# Altium schematic sheet 01_Overview.SchDoc
size A4; DocumentNumber: 1; SheetNumber: 1; SheetTotal: 8
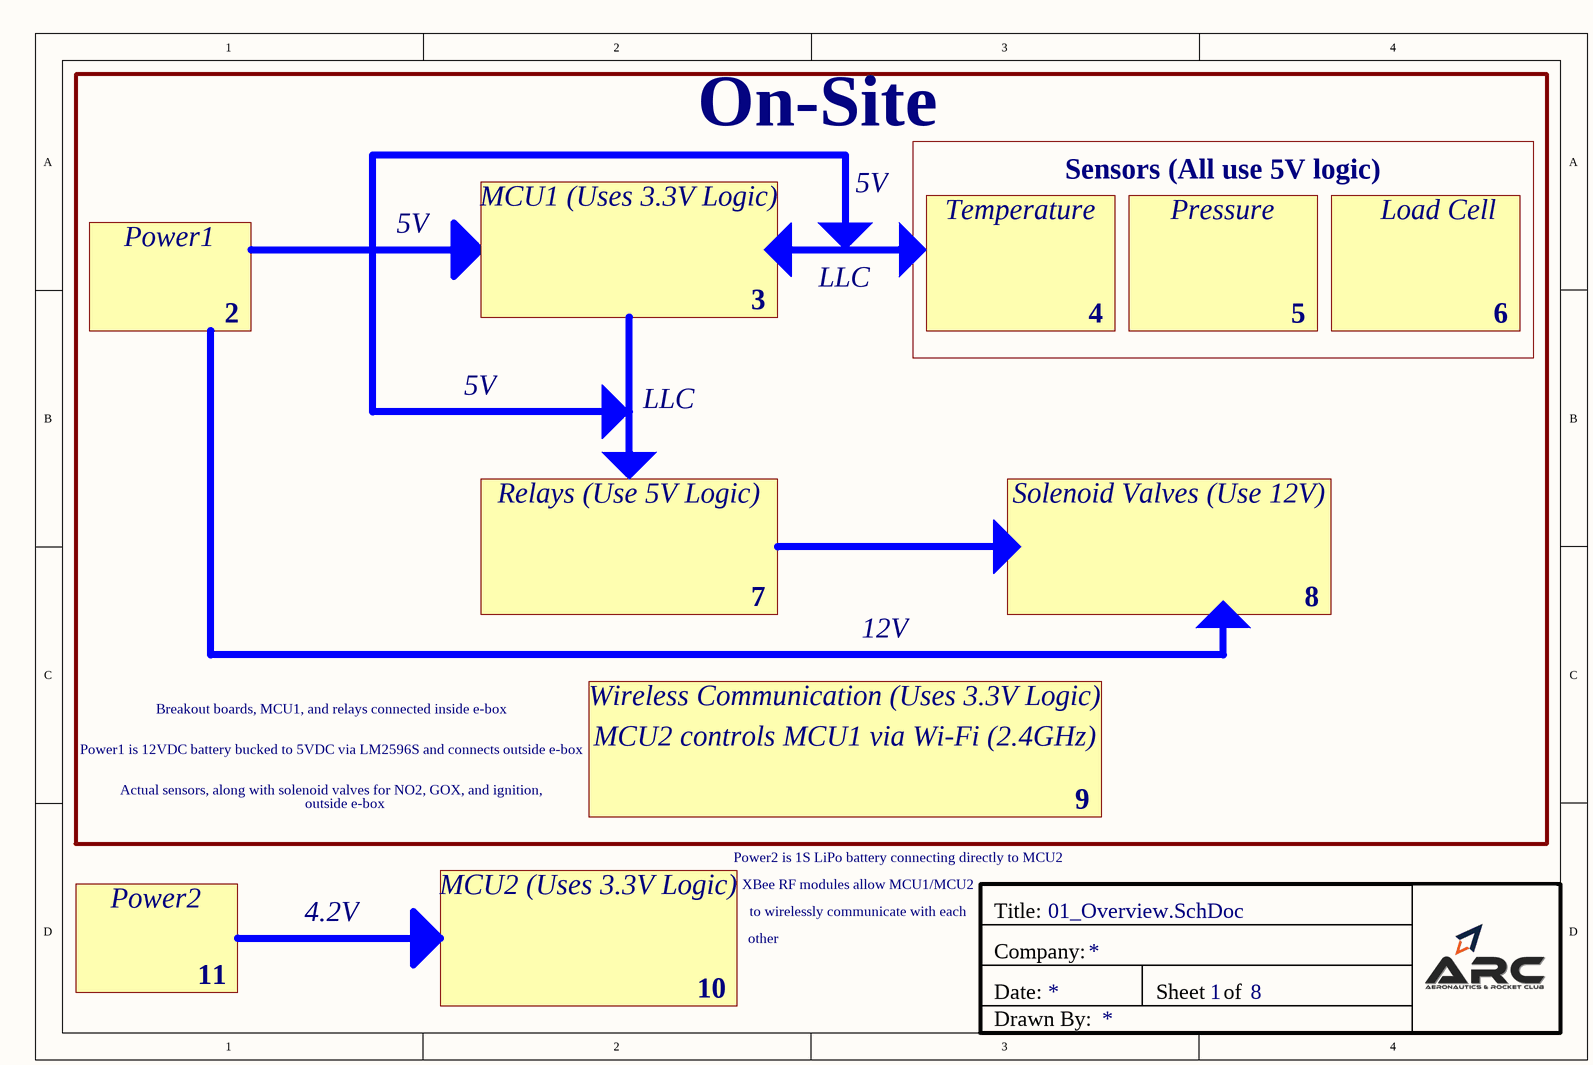
[diagram p0: 01_Overview.SchDoc]

## Notes on the sheet
- On-Site
- MCU1 (Uses 3.3V Logic)
- 5V
- Temperature
- Sensors (All use 5V logic)
- Pressure
- Load Cell
- Power1
- LLC
- 2
- 3
- 4
- 5
- 6
- Relays (Use 5V Logic)
- Solenoid Valves (Use 12V)
- 7
- 8
- 12V
- Breakout boards, MCU1, and relays connected inside e-box
- Power1 is 12VDC battery bucked to 5VDC via LM2596S and connects outside e-box
- Wireless Communication (Uses 3.3V Logic)
- MCU2 controls MCU1 via Wi-Fi (2.4GHz)
- Actual sensors, along with solenoid valves for NO2, GOX, and ignition,
- outside e-box
- 9
- MCU2 (Uses 3.3V Logic)
- XBee RF modules allow MCU1/MCU2
- Power2 is 1S LiPo battery connecting directly to MCU2
- Power2
- 4.2V
- other
- to wirelessly communicate with each
- 11
- 10
- Title:
- Company:
- Date:
- Sheet
- of
- Drawn By: